# EasyEDA schematic easyeda.json
TITLE: Coaster; REV: 0.2; Date: 2024-08-01; Sheet: 1/1; Drawn By: omtinez; Company: Wahltinez Bar
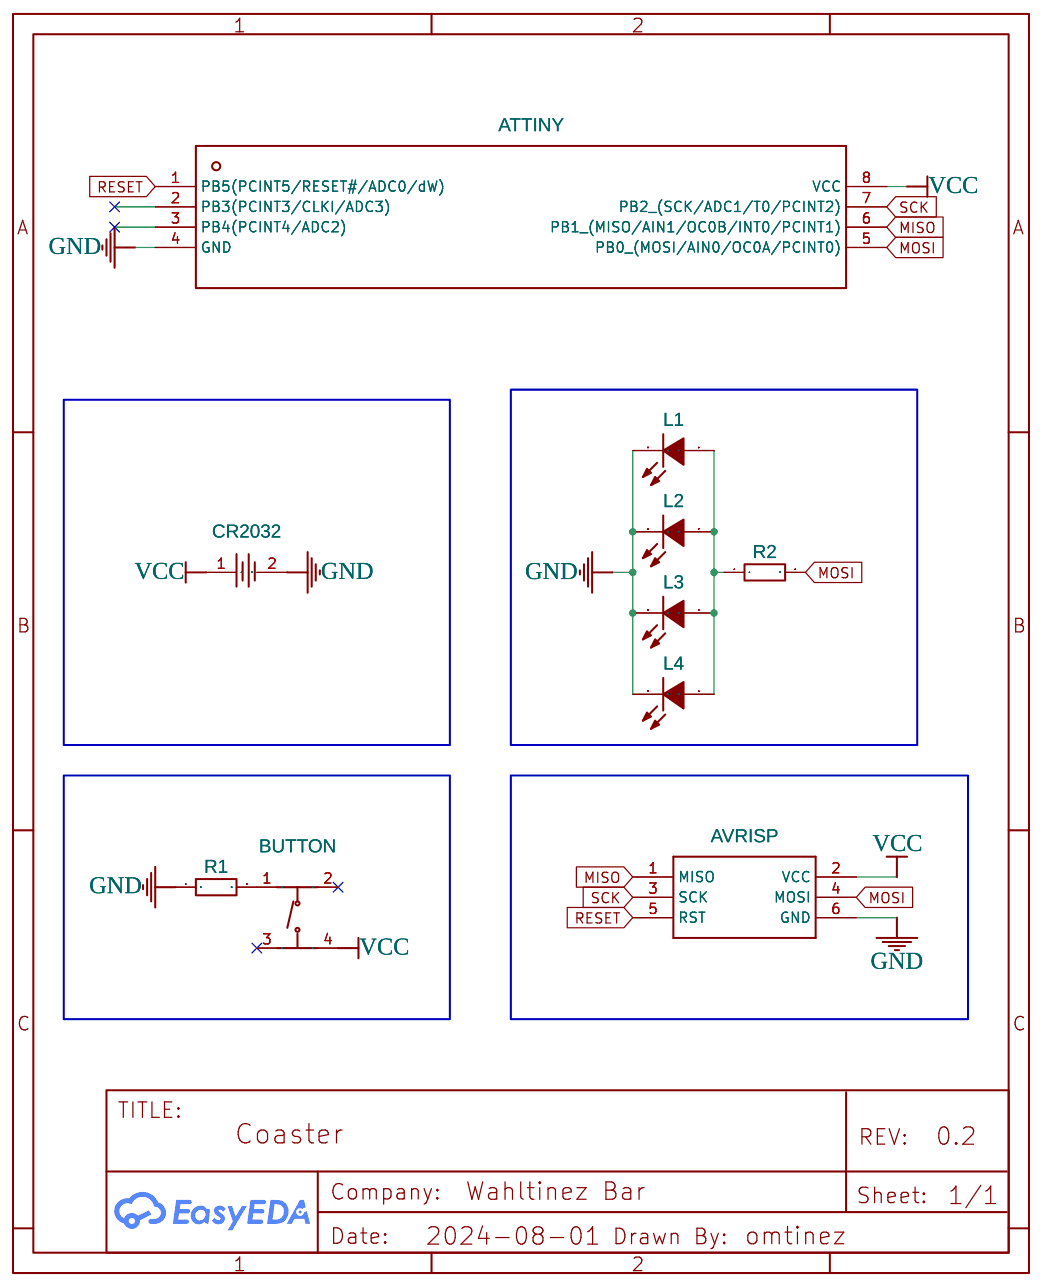
[diagram p0: schematic sheet]

## Parts
ATTINY  ATTINY13A-SSUR  [SOIC-8_L5.0-W4.0-P1.27-LS6.0-BL]
BUTTON  TS-1187A-B-A-B  [SW-SMD_4P-L5.1-W5.1-P3.70-LS6.5-TL-2]
CR2032  MY-2032-12  [BAT-SMD_MY-2032-12]
ISP  AVRISP  [AVRISP]
L1  0603White light_C2290  [LED0603-R-RD_WHITE]
L2  0603White light_C2290  [LED0603-R-RD_WHITE]
L3  0603White light_C2290  [LED0603-R-RD_WHITE]
L4  0603White light_C2290  [LED0603-R-RD_WHITE]
R1  100mΩ  [R1206]
R2  100mΩ  [R1206]

## Library data of the parts
ATTINY = ATTINY13A-SSUR: Supplier: LCSC; Manufacturer: MICROCHIP(美国微芯); Supplier Part: C40382; JLCPCB Part Class: Extended Part
BUTTON = TS-1187A-B-A-B: Contributor: LCSC; Supplier: LCSC; Supplier Part: C318884; Manufacturer: XKB Connectivity(中国星坤); JLCPCB Part Class: Basic Part
CR2032 = MY-2032-12: Contributor: LCSC; Supplier: LCSC; Supplier Part: C964833; Manufacturer: MYOUNG(美阳); JLCPCB Part Class: Extended Part
ISP = AVRISP: Contributor: Adafruit
L1-L4 = 0603White light_C2290: Supplier: LCSC; Manufacturer: KENTO; Manufacturer Part: KT-0603白灯; Supplier Part: C2290; JLCPCB Part Class: Basic Part
R1 R2 = 1206W4F100LT5E: Supplier: LCSC; Manufacturer: UNI-ROYAL(厚声); Supplier Part: C25334; JLCPCB Part Class: Basic Part

## Nets
GND: ATTINY.4(GND) CR2032.2 ISP.6(GND) L1.2(K) L2.2(K) L3.2(K) L4.2(K) R1.1
VCC: ATTINY.8(VCC) BUTTON.4(D) CR2032.1 ISP.2(VCC)
MISO: ATTINY.6(PB1 (MISO/AIN1/OC0B/INT0/PCINT1)) ISP.1(MISO)
MOSI: ATTINY.5(PB0 (MOSI/AIN0/OC0A/PCINT0)) ISP.4(MOSI) R2.2
RESET: ATTINY.1(PB5(PCINT5/RESET#/ADC0/dW)) ISP.5(RST)
SCK: ATTINY.7(PB2 (SCK/ADC1/T0/PCINT2)) ISP.3(SCK)
Net-(BUTTON-1): BUTTON.1(A) R1.2
Net-(L1-1): L1.1(A) L2.1(A) L3.1(A) L4.1(A) R2.1

Not connected (* = marked no-connect by the designer): ATTINY 2(PB3(PCINT3/CLKI/ADC3)) 3(PB4(PCINT4/ADC2)); BUTTON 2(B)* 3(C)*
